# EasyEDA Pro project eLight_core.epro, board PCB_linear
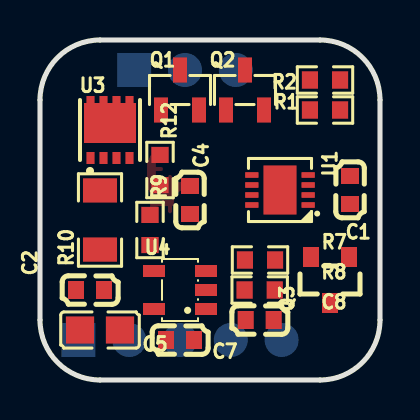
[diagram p9: board, top side]
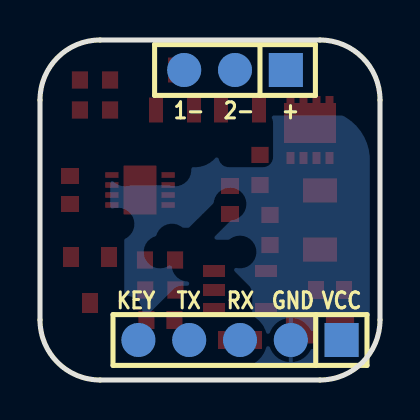
[diagram p10: board, bottom side, seen from below]

Outline 17 x 17 mm; copper layers: Top Layer, Bottom Layer. Coordinates in mm from the lower left corner of the outline.
Outline path: 0,14 0,3 arc(0.88,0.88) 3,0 14,0 arc(16.12,0.88) 17,3 17,14 arc(16.12,16.12) 14,17 3,17 arc(0.88,16.12) 0,14
Stack: Top Layer 0.035mm / Dielectric1 0.71mm FR4 er 4.5 / Bottom Layer 0.035mm

## Design rules (mm)
template: 用户自定义配置
spacing safeClearance (default): track to track 0.152, other pairs 0.152 to 0.3
track width trackWidth (default): min 0.127, default 0.254, max 2.54
differential pair differentialPair (default): width min 0.127, default 0.254, max 2.54; gap min 0.152, default 0.152
via viaSize (default): diameter min 0.5, default 0.61, max 10; hole min 0.3, default 0.305, max 5.999
net GND uses copperRegion1
net $1N3207 uses copperRegion1

## Placement (name value [footprint] x y rotation side)
C1  1uF  [C0603]  15.5 9.5 270 top
C2  10uF  [C0603]  2.5 4.5 180 top
C4  100pF  [C0603]  7.5 9 270 top
C5  22uF  [C0805]  3 2.5 180 top
C7  100nF  [C0603]  7 2 180 top
C8  1uF  [C0603]  10.98 3 180 top
H1  PZ254V-11-05P  [HDR-TH_5P-P2.54-V-M]  7 2 0 bottom
H2  PZ254V-11-03P  [HDR-TH_3P-P2.54-V-M]  7.25 15.5 0 bottom
Q1  AO3400A  [SOT-23-3_L2.9-W1.3-P1.90-LS2.4-BR]  7 14.5 270 top
Q2  AO3400A  [SOT-23-3_L2.9-W1.3-P1.90-LS2.4-BR]  10.25 14.5 270 top
Q3  AO3401A  [SOT-23_L2.9-W1.3-P1.90-LS2.4-BR]  14.5 5 90 top
R1  100kΩ  [R0603]  14.25 13.5 180 top
R2  SDNT1608X104F4250FTF  [R0603]  14.25 15 0 top
R7  100kΩ  [R0603]  11 6 180 top
R8  1kΩ  [R0603]  10.98 4.5 180 top
R9  1kΩ  [R0603]  5.5 7.5 270 top
R10  10mΩ  [R1206]  3 8 90 top
R12  10Ω  [R0603]  6 10.5 270 top
U1  STC8G1K08A-36I-DFN8  [DFN-8_L3.0-W3.0-P0.50-BL-EP]  12 9.5 90 top
U3  AON7404G  [DFN-8_L3.0-W3.0-P0.65-BL-2]  3.5 12.5 0 top
U4  GS8551-TR  [SOT-23-5_L3.0-W1.7-P0.95-LS2.8-BR]  7 4.5 0 top

## Footprints (pads in the part's own frame, mm; a bottom-side part is the same pattern mirrored in y, then rotated)
C0603
  rect 0.8x0.9 smd: 1(-0.7,0) 2(0.7,0)
C0805
  rect 1.41x1.35 smd: 1(-1,0) 2(1,0)
DFN-8_L3.0-W3.0-P0.50-BL-EP
  rect 0.28x0.665 smd: 1(-0.75,-1.407) 2(-0.25,-1.407) 3(0.25,-1.407) 4(0.75,-1.407) 5(0.75,1.407) 6(0.25,1.407) 7(-0.25,1.407) 8(-0.75,1.407)
  rect 2.45x1.65 smd: 9(0,0)
DFN-8_L3.0-W3.0-P0.65-BL-2
  rect 0.4x0.6 smd: 1(-0.975,-1.4) 2(-0.325,-1.4) 3(0.325,-1.4) 4(0.975,-1.4) 5(0.975,1.4) 6(0.325,1.4) 7(-0.325,1.4) 8(-0.975,1.4)
  rect 2.6x2 smd: 9(0,0.35)
HDR-TH_3P-P2.54-V-M
  rect 1.7x1.7 smd: 1(-2.54,0)
  round 1.7 smd: 2(0,0) 3(2.54,0)
HDR-TH_5P-P2.54-V-M
  rect 1.7x1.7 smd: 1(-5.08,0)
  round 1.7 smd: 2(-2.54,0) 3(0,0) 4(2.54,0) 5(5.08,0)
R0603
  rect 0.806x0.864 smd: 1(-0.753,0) 2(0.753,0)
R1206
  rect 1.208x1.701 smd: 1(-1.479,0) 2(1.479,0)
SOT-23-3_L2.9-W1.3-P1.90-LS2.4-BR
  rect 1.25x0.7 smd: 1(1,-0.95) 2(1,0.95) 3(-1,0)
SOT-23-5_L3.0-W1.7-P0.95-LS2.8-BR
  rect 1.1x0.6 smd: 1(1.3,-0.95) 2(1.3,0) 3(1.3,0.95) 4(-1.3,0.95) 5(-1.3,-0.95)
SOT-23_L2.9-W1.3-P1.90-LS2.4-BR
  rect 1x0.8 smd: 1(1.15,-0.95) 2(1.15,0.95) 3(-1.15,0)

## Nets
As in the schematic.

## Copper pours and planes (outline as drawn; the poured copper is in the pictures)
GND on Top Layer: 5.35,11.33 7.5,11.33 7.5,7 5.35,7
GND on Bottom Layer: 0,13.22 14,13.22 14,0.61 0,0.61

## Text on the board
Bottom Silkscreen Layer: VCC | + | GND | RX | 2- | TX | 1- | KEY | eleqian | 20250322 | eLight-Core
